# Altium schematic sheet QUTMS-TSAL-S01.SchDoc: LED Driver
size A3; DrawnBy: Joseph Richards; DocumentNumber: 2; Revision: 2; SheetNumber: 2; SheetTotal: 5
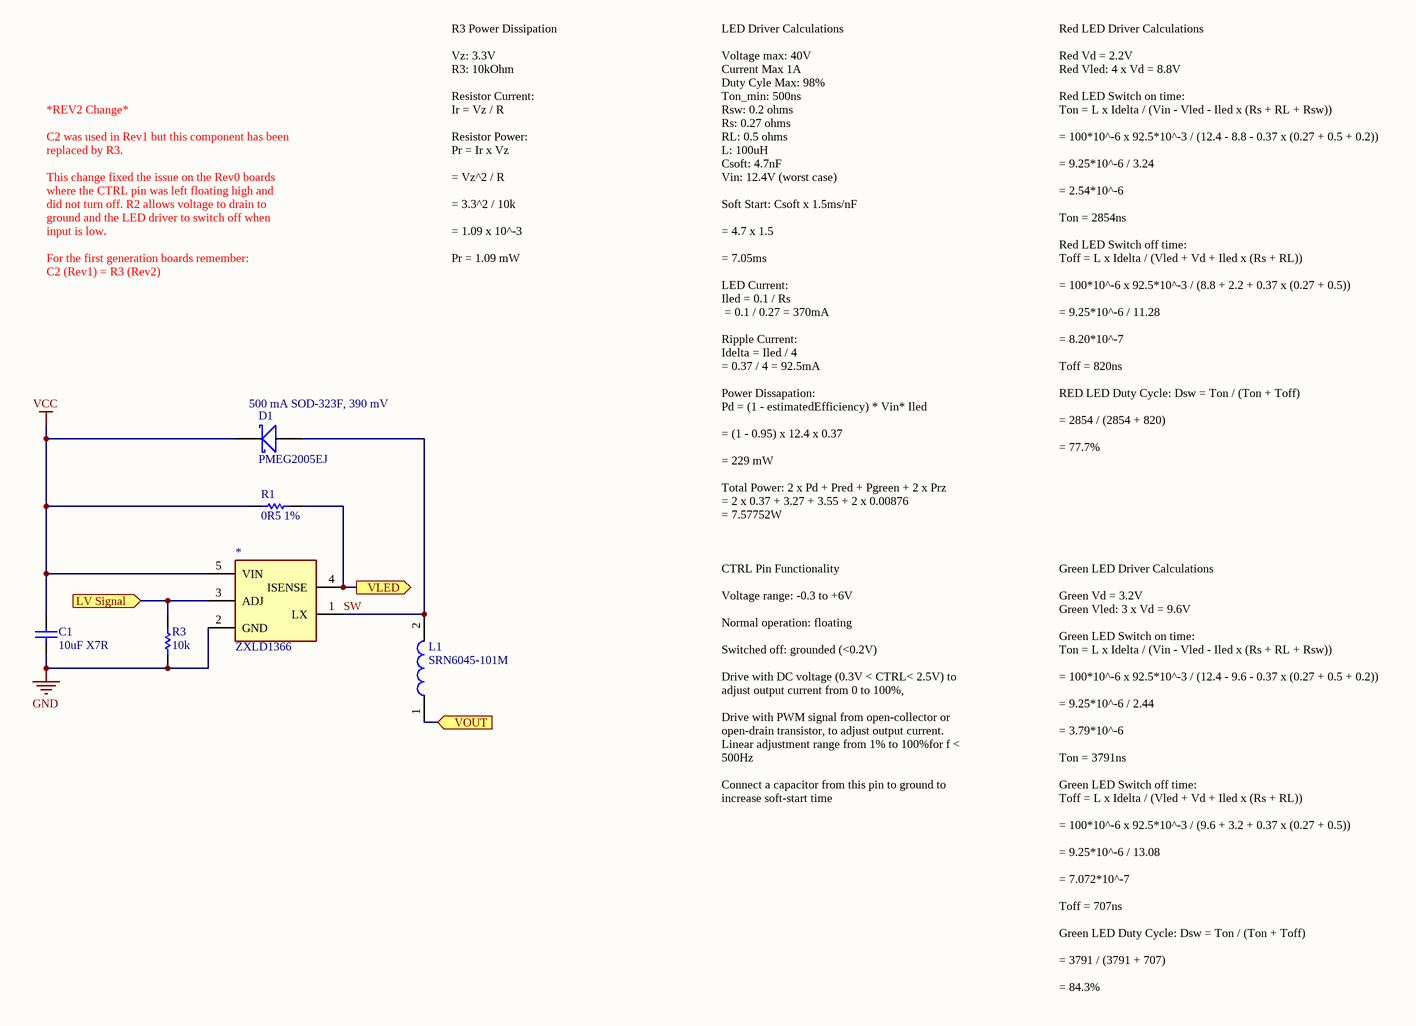
[diagram p0: QUTMS-TSAL-S01.SchDoc]

## Parts
*  ZXLD1366  [SOT95P280X100-5N]
C1  10uF X7R  [Cap_Ceramic_0603]
D1  PMEG2005EJ  [SOD-323F]
L1  SRN6045-101M  [Bourns Inductor 6x6x4.5mm]
R1  0R5 1%  [RESC1005X04N]
R3  10k  [Res_ThinFilm_0603]

## Ports
LV Signal (in), VLED (out), VOUT (in)

## Nets
GND: *.2(GND) C1.1 R3.1
VCC: *.5(VIN) C1.2 D1.K(Cathode) R1.1
LV Signal: *.3(ADJ) R3.2 ; port LV Signal
SW: *.1(LX) D1.A(Anode) L1.2
VLED: *.4(ISENSE) R1.2 ; port VLED
VOUT: L1.1 ; port VOUT

## Notes on the sheet
- *REV2 Change*
  C2 was used in Rev1 but this component has been replaced by R3.
  This change fixed the issue on the Rev0 boards where the CTRL pin was left floating high and did not turn off. R2 allows voltage to drain to ground and the LED driver to switch off when input is low.
  For the first generation boards remember:
  C2 (Rev1) = R3 (Rev2)
- R3 Power Dissipation
  Vz: 3.3V
  R3: 10kOhm
  Resistor Current:
  Ir = Vz / R
  Resistor Power:
  Pr = Ir x Vz
  = Vz^2 / R
  = 3.3^2 / 10k
  = 1.09 x 10^-3
  Pr = 1.09 mW
- (near D1) 500 mA SOD-323F, 390 mV
- Red LED Driver Calculations
  Red Vd = 2.2V
  Red Vled: 4 x Vd = 8.8V
  Red LED Switch on time:
  Ton = L x Idelta / (Vin - Vled - Iled x (Rs + RL + Rsw))
  = 100*10^-6 x 92.5*10^-3 / (12.4 - 8.8 - 0.37 x (0.27 + 0.5 + 0.2))
  = 9.25*10^-6 / 3.24
  = 2.54*10^-6
  Ton = 2854ns
  Red LED Switch off time:
  Toff = L x Idelta / (Vled + Vd + Iled x (Rs + RL))
  = 100*10^-6 x 92.5*10^-3 / (8.8 + 2.2 + 0.37 x (0.27 + 0.5))
  = 9.25*10^-6 / 11.28
  = 8.20*10^-7
  Toff = 820ns
  RED LED Duty Cycle: Dsw = Ton / (Ton + Toff)
  = 2854 / (2854 + 820)
  = 77.7%
- LED Driver Calculations
  Voltage max: 40V
  Current Max 1A
  Duty Cyle Max: 98%
  Ton_min: 500ns
  Rsw: 0.2 ohms
  Rs: 0.27 ohms
  RL: 0.5 ohms
  L: 100uH
  Csoft: 4.7nF
  Vin: 12.4V (worst case)
  Soft Start: Csoft x 1.5ms/nF
  = 4.7 x 1.5
  = 7.05ms
  LED Current:
  Iled = 0.1 / Rs
  = 0.1 / 0.27 = 370mA
  Ripple Current:
  Idelta = Iled / 4
  = 0.37 / 4 = 92.5mA
  Power Dissapation:
  Pd = (1 - estimatedEfficiency) * Vin* Iled
  = (1 - 0.95) x 12.4 x 0.37
  = 229 mW
  Total Power: 2 x Pd + Pred + Pgreen + 2 x Prz
  = 2 x 0.37 + 3.27 + 3.55 + 2 x 0.00876
  = 7.57752W
- CTRL Pin Functionality
  Voltage range: -0.3 to +6V
  Normal operation: floating
  Switched off: grounded (<0.2V)
  Drive with DC voltage (0.3V < CTRL< 2.5V) to adjust output current from 0 to 100%,
  Drive with PWM signal from open-collector or open-drain transistor, to adjust output current. Linear adjustment range from 1% to 100%for f < 500Hz
  Connect a capacitor from this pin to ground to increase soft-start time
- Green LED Driver Calculations
  Green Vd = 3.2V
  Green Vled: 3 x Vd = 9.6V
  Green LED Switch on time:
  Ton = L x Idelta / (Vin - Vled - Iled x (Rs + RL + Rsw))
  = 100*10^-6 x 92.5*10^-3 / (12.4 - 9.6 - 0.37 x (0.27 + 0.5 + 0.2))
  = 9.25*10^-6 / 2.44
  = 3.79*10^-6
  Ton = 3791ns
  Green LED Switch off time:
  Toff = L x Idelta / (Vled + Vd + Iled x (Rs + RL))
  = 100*10^-6 x 92.5*10^-3 / (9.6 + 3.2 + 0.37 x (0.27 + 0.5))
  = 9.25*10^-6 / 13.08
  = 7.072*10^-7
  Toff = 707ns
  Green LED Duty Cycle: Dsw = Ton / (Ton + Toff)
  = 3791 / (3791 + 707)
  = 84.3%
- Revision History:
- Sheet Title:
- Rev
- Date
- Description
- Project:
- Size:
- Drawn By:
- A3
- Number:
- Revision:
- Sheet
- Version:
- of
- QUT Motorsport
- O-120, Gardens Point
- 2 George Street
- Brisbane, QLD 4000
- Australia
- Print Date:
- Print Time:
- File Name:

## Library data of the parts
* = ZXLD136ET5TA
C1 = 10uF 50V 5% X7R 0603: Capacitor, Ceramic, SMD, 10uF, 50V, 5%, X7R, 0603
D1 = PMEG2005EJ: Diode, Schottky, SMD, 20 V, 500 mA, Single, SOD-323F, 2 Pins, 390 mV; ComponentLink1Description: Element14; ComponentLink1URL: https://au.element14.com/nexperia/pmeg2005ej-115/schottky-rect-20v-0-5a-sod323f/dp/1757760
L1 = SRN6045-101M: Inductor, 100 µH, 700 mA, Semishielded, 800 mA, SRN6045 Series, 6mm x 6mm x 4.5mm; ComponentLink1Description: Element14; ComponentLink1URL: https://au.element14.com/bourns/srn6045-101m/inductor-100uh-semi-shielded-power/dp/2061658
R1 = 0R27 1% 0603: Resistor, SMD, 0R27, 0.1W, 1%, 0603
R3 = 10k 5% 0603: Resistor, SMD, 10k, 0.1W, 5%, 0603